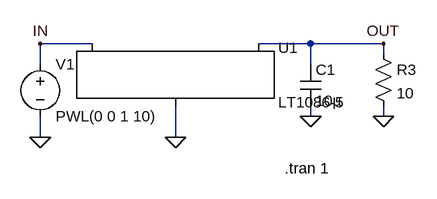
[diagram p0: schematic 1086-5.asc]
1086-5.asc, the LTspice schematic file:
Version 4
SHEET 1 2800 1520
WIRE 1552 896 1472 896
WIRE 1888 896 1808 896
WIRE 2000 896 1888 896
WIRE 2000 912 2000 896
WIRE 1472 928 1472 896
WIRE 1888 928 1888 896
WIRE 1888 1008 1888 992
WIRE 2000 1008 2000 992
WIRE 1472 1040 1472 1008
WIRE 1680 1040 1680 992
FLAG 2000 896 OUT
FLAG 2000 1008 0
FLAG 1472 1040 0
FLAG 1888 1008 0
FLAG 1680 1040 0
FLAG 1472 896 IN
SYMBOL VOLTAGE 1472 912 R0
WINDOW 123 0 0 Left 0
SYMATTR InstName V1
SYMATTR Value PWL(0 0 1 10)
SYMATTR SpiceLine Rser=0.1
SYMBOL RES 1984 896 R0
SYMATTR InstName R3
SYMATTR Value 10
SYMBOL cap 1872 928 R0
SYMATTR InstName C1
SYMATTR Value 10µ
SYMBOL PowerProducts\\LT1086-5 1680 896 R0
SYMATTR InstName U1
TEXT 1848 1088 Left 0 !.tran 1

The netlist it stands for:
* 1086-5.asc
V1 IN 0 PWL(0 0 1 10) Rser=0.1
R3 OUT 0 10
C1 OUT 0 10µ
XU1 0 OUT IN LT1086-5
.tran 1
.backanno
.end